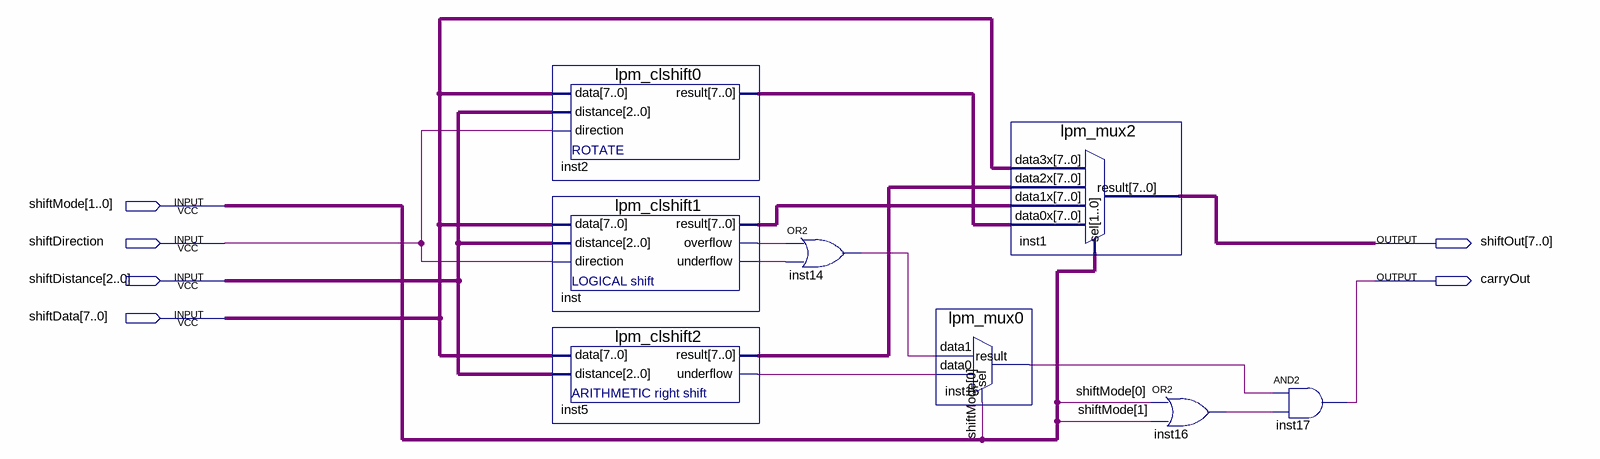
[diagram p0: schematic sheet]
// Quartus schematic shiftBlock.bdf as structural Verilog: 8 symbols, 6 pins
module shiftBlock (
  input  [1:0] shiftMode,
  input  shiftDirection,
  input  [2:0] shiftDistance,
  input  [7:0] shiftData,
  output [7:0] shiftOut,
  output carryOut
);

  wire inst5_underflow, inst14_out, inst15_result, inst16_out, inst_overflow, inst_underflow;
  wire [7:0] inst2_result, inst5_result, inst_result;

  lpm_clshift0 inst2 (.data(shiftData), .distance(shiftDistance), .direction(shiftDirection), .result(inst2_result));
  lpm_clshift1 inst (
    .data(shiftData), .distance(shiftDistance), .direction(shiftDirection), .result(inst_result),
    .overflow(inst_overflow), .underflow(inst_underflow));
  lpm_clshift2 inst5 (.data(shiftData), .distance(shiftDistance), .result(inst5_result), .underflow(inst5_underflow));
  or inst14 (inst14_out, inst_overflow, inst_underflow);
  lpm_mux0 inst15 (.data1(inst14_out), .data0(inst5_underflow), .sel(shiftMode[0]), .result(inst15_result));
  lpm_mux2 inst1 (
    .data3x(shiftData), .data2x(inst5_result), .data1x(inst_result), .data0x(inst2_result), .sel(shiftMode),
    .result(shiftOut));
  or inst16 (inst16_out, shiftMode[0], shiftMode[1]);
  and inst17 (carryOut, inst15_result, inst16_out);
endmodule
